# Altium project I2CMux.PrjPcb
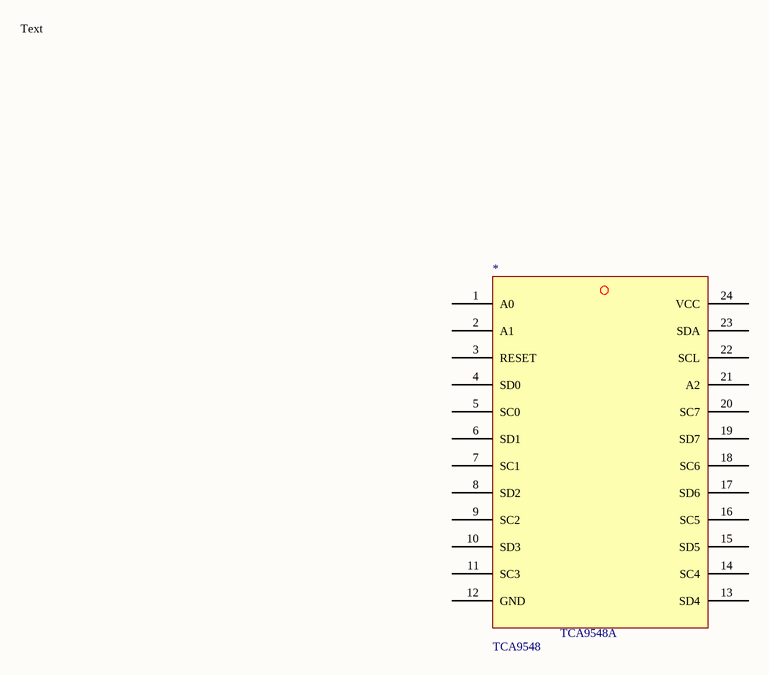
[diagram p0: Sheet1.SchDoc]
1 sheet, 1 parts. Net scope: global (net labels, ports and power ports of the same name join across sheets).

## Sheet Sheet1.SchDoc
size A

### Parts
*  TCA9548  [TSSOP24]

### Nets

Not connected (* = marked no-connect by the designer): * 1(A0) 2(A1) 3(RESET) 4(SD0) 5(SC0) 6(SD1) 7(SC1) 8(SD2) 9(SC2) 10(SD3) 11(SC3) 12(GND) 13(SD4) 14(SC4) 15(SD5) 16(SC5) 17(SD6) 18(SC6) 19(SD7) 20(SC7) 21(A2) 22(SCL) 23(SDA) 24(VCC)

### Notes on the sheet
- Text
- (in symbol TCA9548) TCA9548A